# EAGLE design -Z axis for open source (EAGLE 9.5.2)
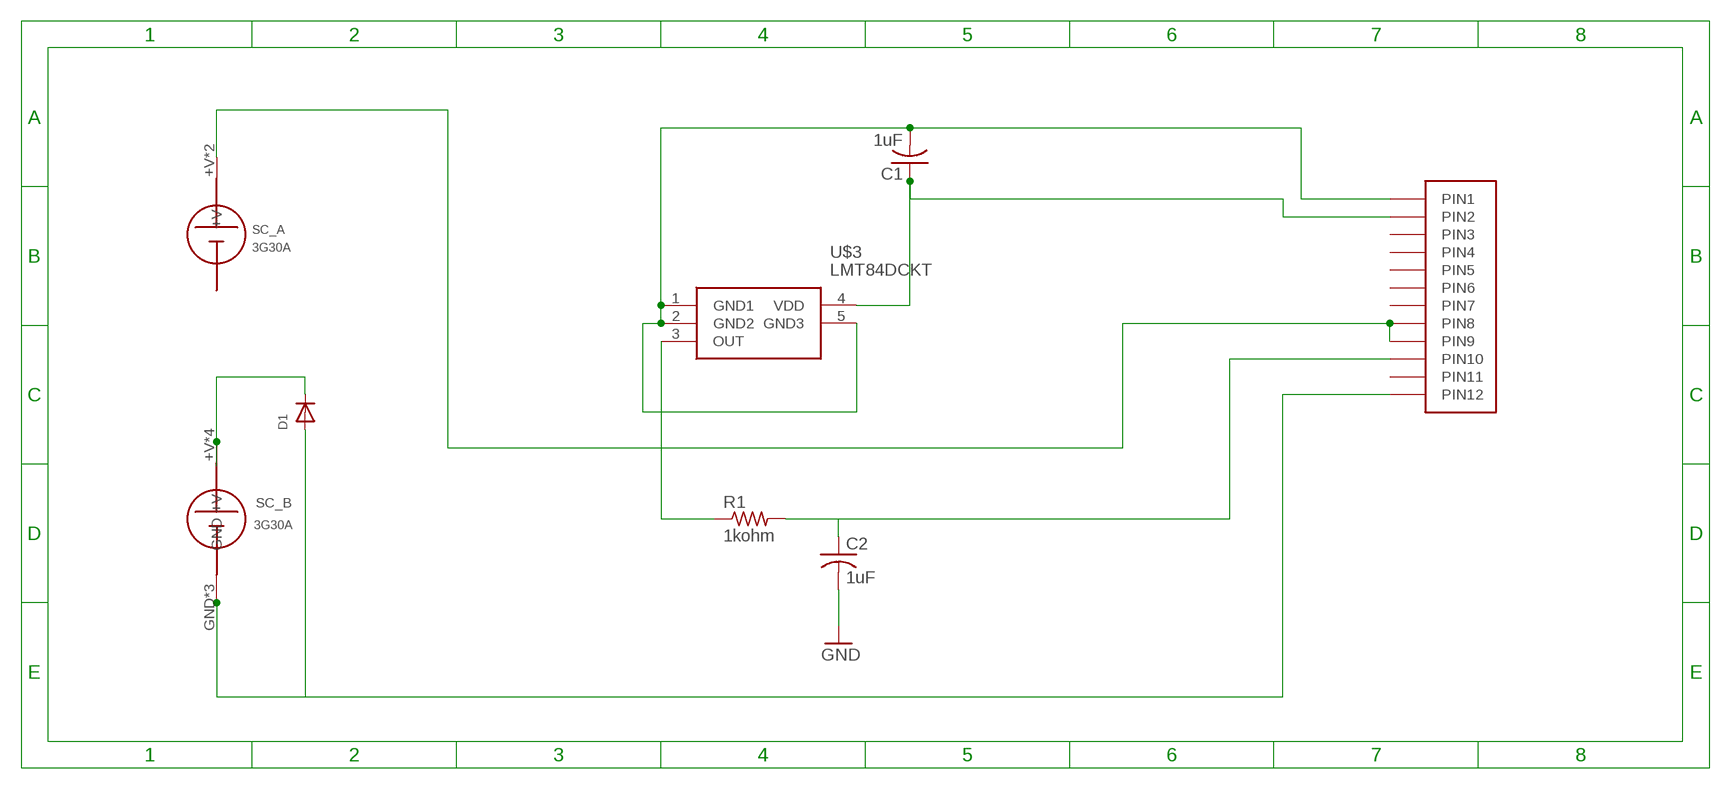
[diagram p0: schematic, sheet 1]

## Parts
C1  1uF  C-USC0805  [C0805]
C2  1uF  C-USC0805  [C0805]
D1  DIODE_SOD-123FL  [SOD-123FL]
R1  1kohm  R-US_R0402  [R0402]
U$1  HEADER12PIN  [HEADER12PIN]
U$3  LMT84DCKT  [SOT65P210X110-5N]
U$4  SC_A  [SC_A]
U$5  SC_B  [SC_B]

## Nets
+V: U$1.P8(PIN8) U$1.P9(PIN9) U$4.+V U$4.+V1(+V)
+VB: D1.C U$5.+V U$5.+V2(+V) U$5.+V3(+V) U$5.+V4(+V)
GND: C1.2 C2.2 D1.A U$1.P1(PIN1) U$1.P12(PIN12) U$3.1(GND1) U$3.2(GND2) U$3.5(GND3) U$5.GND U$5.GND1(GND) U$5.GND2(GND)
N$1: C2.1 R1.2 U$1.P10(PIN10)
N$2: C1.1 U$1.P2(PIN2) U$3.4(VDD)
N$10: R1.1 U$3.3(OUT)
Unconnected: U$1.P3(PIN3) U$1.P4(PIN4) U$1.P5(PIN5) U$1.P6(PIN6) U$1.P7(PIN7) U$1.P11(PIN11)

## Library data of the parts
C1 C2 = adafruit:C-US: CAPACITOR, American symbol
D1 = adafruit:DIODE: Diode SMADIODE - SMA Surface Mount Package 20V 1A Schottky Diode Digikey: 641-1014-6-ND DO-1N4148 - Through Hole Small Current Diode SOD-123 20V 1 A (.5mV Vf) Schottky Diode - Digikey: MBRX120TPMSCT-ND SOD-323 10V 570mA (.38mV Vf, 3ns) Schottky Diode - Digikey: ZLLS410CT-ND SOD-523 30V 30mA Schottky Diode (RB751S-40TE61) - Digikey: RB751S-40TE61CT-ND SOT23-R/W - SOT23 Package (R = Solder Paste/Reflow Ovens, W = Hand-Soldering) BAT54Film 40V 300mA - Digikey: 497-7162-1-ND
R1 = adafruit:R-US_: RESISTOR, American symbol
U$1 = BIRDS:HEADER12PIN
U$3 = LMT84DCKT:LMT84DCKT: 1.5V-Capable, 10 uA Analog Output Temperature Sensor in SC70 and TO-92 Source: Datasheet <http://uk.rs-online.com/web/p/products/8115860>; DESCRIPTION: 1.5V-Capable, 10 uA Analog Output Temperature Sensor in SC70 and TO-92; HEIGHT: 1.1mm; MANUFACTURER_NAME: Texas Instruments; MANUFACTURER_PART_NUMBER: LMT84DCKT; RS_PART_NUMBER: 8115860
U$4 = SC_A:SC_A
U$5 = SC_B:SC_B

## Board
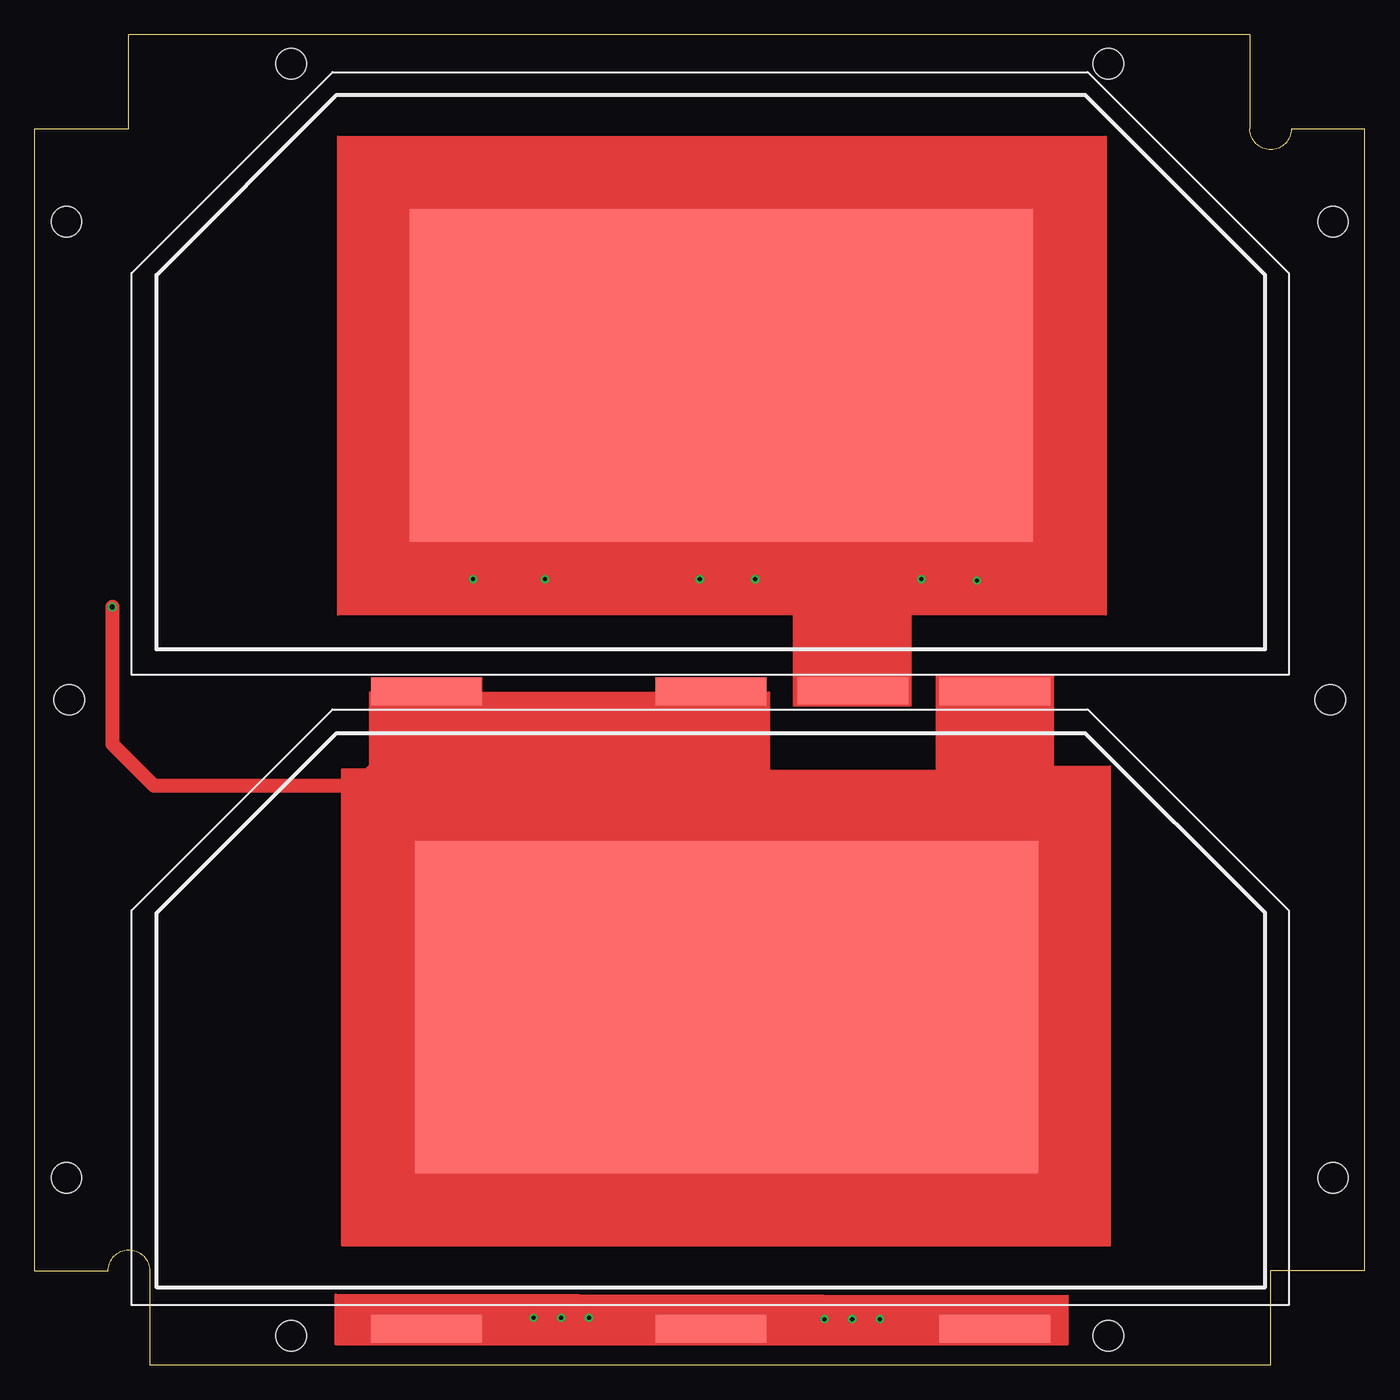
[diagram p1: board, top side]
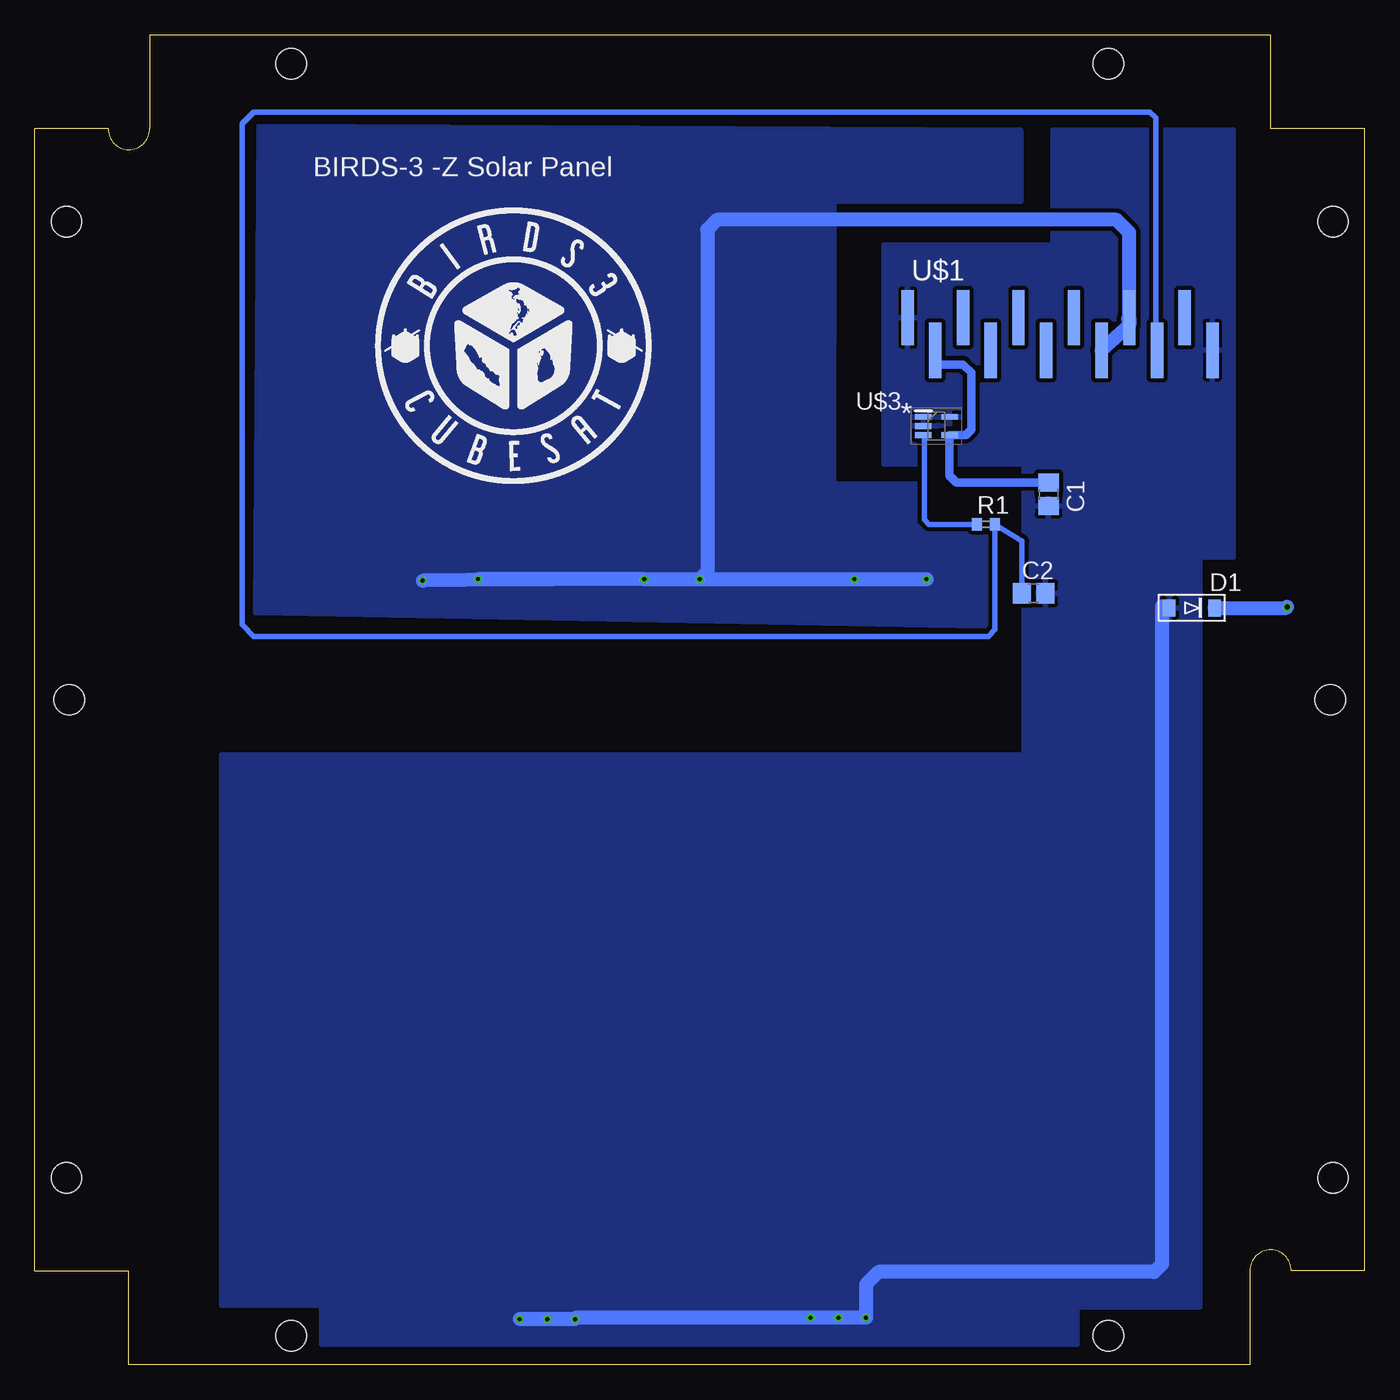
[diagram p2: board, bottom side, seen from below]

Size 96 x 96 mm. Coordinates in mm from the lower left corner, seen from the top.
Outline: 0,6.8 0,89.2 6.8,89.2 6.8,96 87.7,96 87.7,89.2 arc180 90.7,89.2 96,89.2 96,6.8 89.2,6.8 89.2,0 8.3,0 8.3,6.8 arc180 5.3,6.8 0,6.8
Copper layers (1+2*15+16): Top 0.018mm / dielectric 0.25mm / Route2 0.035mm / dielectric 1mm / Route15 0.035mm / dielectric 0.25mm / Bottom 0.018mm
Design rules "pban_5mil-l4": minimum track width 5mil, minimum drill 0.3mm, track to track 5mil, track to pad 0.229mm, pad to pad 5mil, via to via 5mil, smd to smd 5mil, copper to edge 0.5mm, drill to drill 0.5mm, minimum pad ring 0.15mm, minimum via ring 0.15mm, stop-mask expansion 4mil, vias tented up to drill 0.35mm, thermal gap 10mil
Holes 2.2 mm at 77.5,93.9 18.5,93.9 77.5,2.1 2.5,48 93.5,48 2.3,13.5 2.3,82.5 93.7,82.5 93.7,13.5 18.5,2.1

### Footprints (pad centres in the part's own frame; a part is rotated, then mirrored left to right if it is on the bottom)
C0805 = smd 1.3 x 1.5: 1 -0.85,0; 2 0.85,0
SOD-123FL = smd 0.91 x 1.22 bottom: A 1.637,0; C -1.637,0
R0402 = smd 0.7 x 0.9: 1 -0.65,0; 2 0.65,0
HEADER12PIN = smd 4 x 0.89: P1 0,0; P2 2.35,2; P3 0,4; P4 2.35,6; P5 0,8; P6 2.35,10; P7 0,12; P8 2.35,14; P9 0,16; P10 2.35,18; P11 0,20; P12 2.35,22
SOT65P210X110-5N = smd 1.2 x 0.4: 1 -0.95,0.65; 2 -0.95,0; 3 -0.95,-0.65; 4 0.95,-0.65; 5 0.95,0.65
SC_A = smd 45 x 24: +V 40.75,19.75 | smd 8 x 2: +V1 50.25,-3
SC_B = smd 45 x 24: +V 41.14,20.22 | smd 8 x 2: +V2 19.5,43; +V3 40,43; +V4 60.5,43; GND 60.5,-3; GND1 19.5,-3; GND2 40,-3

### Placement (x,y rotation side)
C1  22.82,62.83 270 bottom
C2  23.89,55.68 0 bottom
D1  12.48,54.63 0 top
R1  27.35,60.66 0 bottom
U$1  33,75.58 270 bottom
U$3  30.92,67.75 0 bottom
U$4  8.8,51.65 0 top
U$5  8.8,5.6 0 top

### Tracks (layer width: path | path; a pad name or v marks a point on that pad's centre or on a via)
+V  (via drill 0.3)
  Top 0.152: 53.3,56.7 49.55,60.45 | 49.55,60.45 U$4.+V 49.55,71.3 | v64,56.7 49.55,60.39 49.55,60.45
  Top 1.016: 53.4,56.8 53.3,56.7 | U$4.+V1 58.74,48.96 58.74,54.8 60.42,56.48 67.88,56.48 v68,56.6
  Bottom 1.016: v68,56.6 58.64,56.7 v64,56.7 v52,56.7 v48,56.7 | 17.09,75.49 U$1.P9 | U$1.P9 17,75.05 U$1.P8 | U$1.P9 17,81.72 17.92,82.64 46.74,82.64 47.45,81.93 47.45,57.25 v48,56.7 | v48,56.7 v36.84,56.7 v31.64,56.7
  pour Bottom (isolate 0.305): 24.86,89.11 79.8,89.41 80.06,54.31 25.56,53.29 25.27,63.56 38.36,63.55 38.31,83.99 24.82,83.99 24.82,88.92
+VB  (via drill 0.35)
  Top 0.406: 69.28,38.71 69.28,38.09 65.57,41.8 22.95,41.8 28.3,47.15 U$5.+V2 | 69.28,38.71 69.28,48.58 U$5.+V4 | U$5.+V3 48.8,41.46 46.97,39.63 68.76,39.63 66.91,37.78 66.91,36.34 | 66.91,34.8 66.91,36.34 | 66.91,36.34 69.28,38.71
  Top 1.016: U$5.+V 22.95,41.8 8.6,41.8 5.61,44.79 v5.61,54.7
  Bottom 1.016: D1.C 5.68,54.63 v5.61,54.7
GND  (via drill 0.3)
  Top 0.61: 47.9,3.5 48.43,2.97 | 48.43,2.97 U$5.GND2 56.2,2.6 v57,3.3 | v61,3.3 68.41,3.3 U$5.GND | U$5.GND1 35.2,2.6 v36,3.4 | v40,3.4 42.46,3.4 43.1,2.76 48.22,2.76 48.43,2.97
  Bottom 1.016: 14.64,54.76 14.64,7.26 15.2,6.7 35.1,6.7 36,5.8 v36,3.4 v38,3.4 v40,3.4 56.9,3.4 v57,3.3 v59,3.3 v61,3.3
  pour Bottom (isolate 0.305): 22.5,89.1 22.5,80.8 34.7,80.8 34.7,65 24.6,65 24.6,44 82.5,44 82.5,4.3 75.3,4.3 75.3,1.5 20.8,1.5 20.8,4.2 11.9,4.2 11.9,58.3 9.5,58.3 9.5,89.1
N$1
  Bottom 0.406: U$1.P10 15.1,73.15 15.1,90 15.5,90.4 80.2,90.4 81.03,89.57 81.03,53.43 80.18,52.58 27.18,52.58 26.7,53.06 R1.2 24.74,59.45 C2.1
N$2
  Bottom 0.61: U$1.P2 31.1,72.95 31.1,72.2 29,72.2 28.4,71.6 28.4,67.5 28.8,67.1 U$3.4 29.97,64.17 29.48,63.68 C1.1
N$10
  Bottom 0.305: 31.9,67.07 U$3.3
  Bottom 0.406: R1.1 31.46,60.66 31.8,61 31.8,66.97 31.9,67.07

### Text on the board
bPlace: BIRDS-3 -Z Solar Panel
bNames: U$1 | *